# Altium schematic sheet mx8m_phy.SchDoc
size A2; SheetNumber: 8; SheetTotal: 15
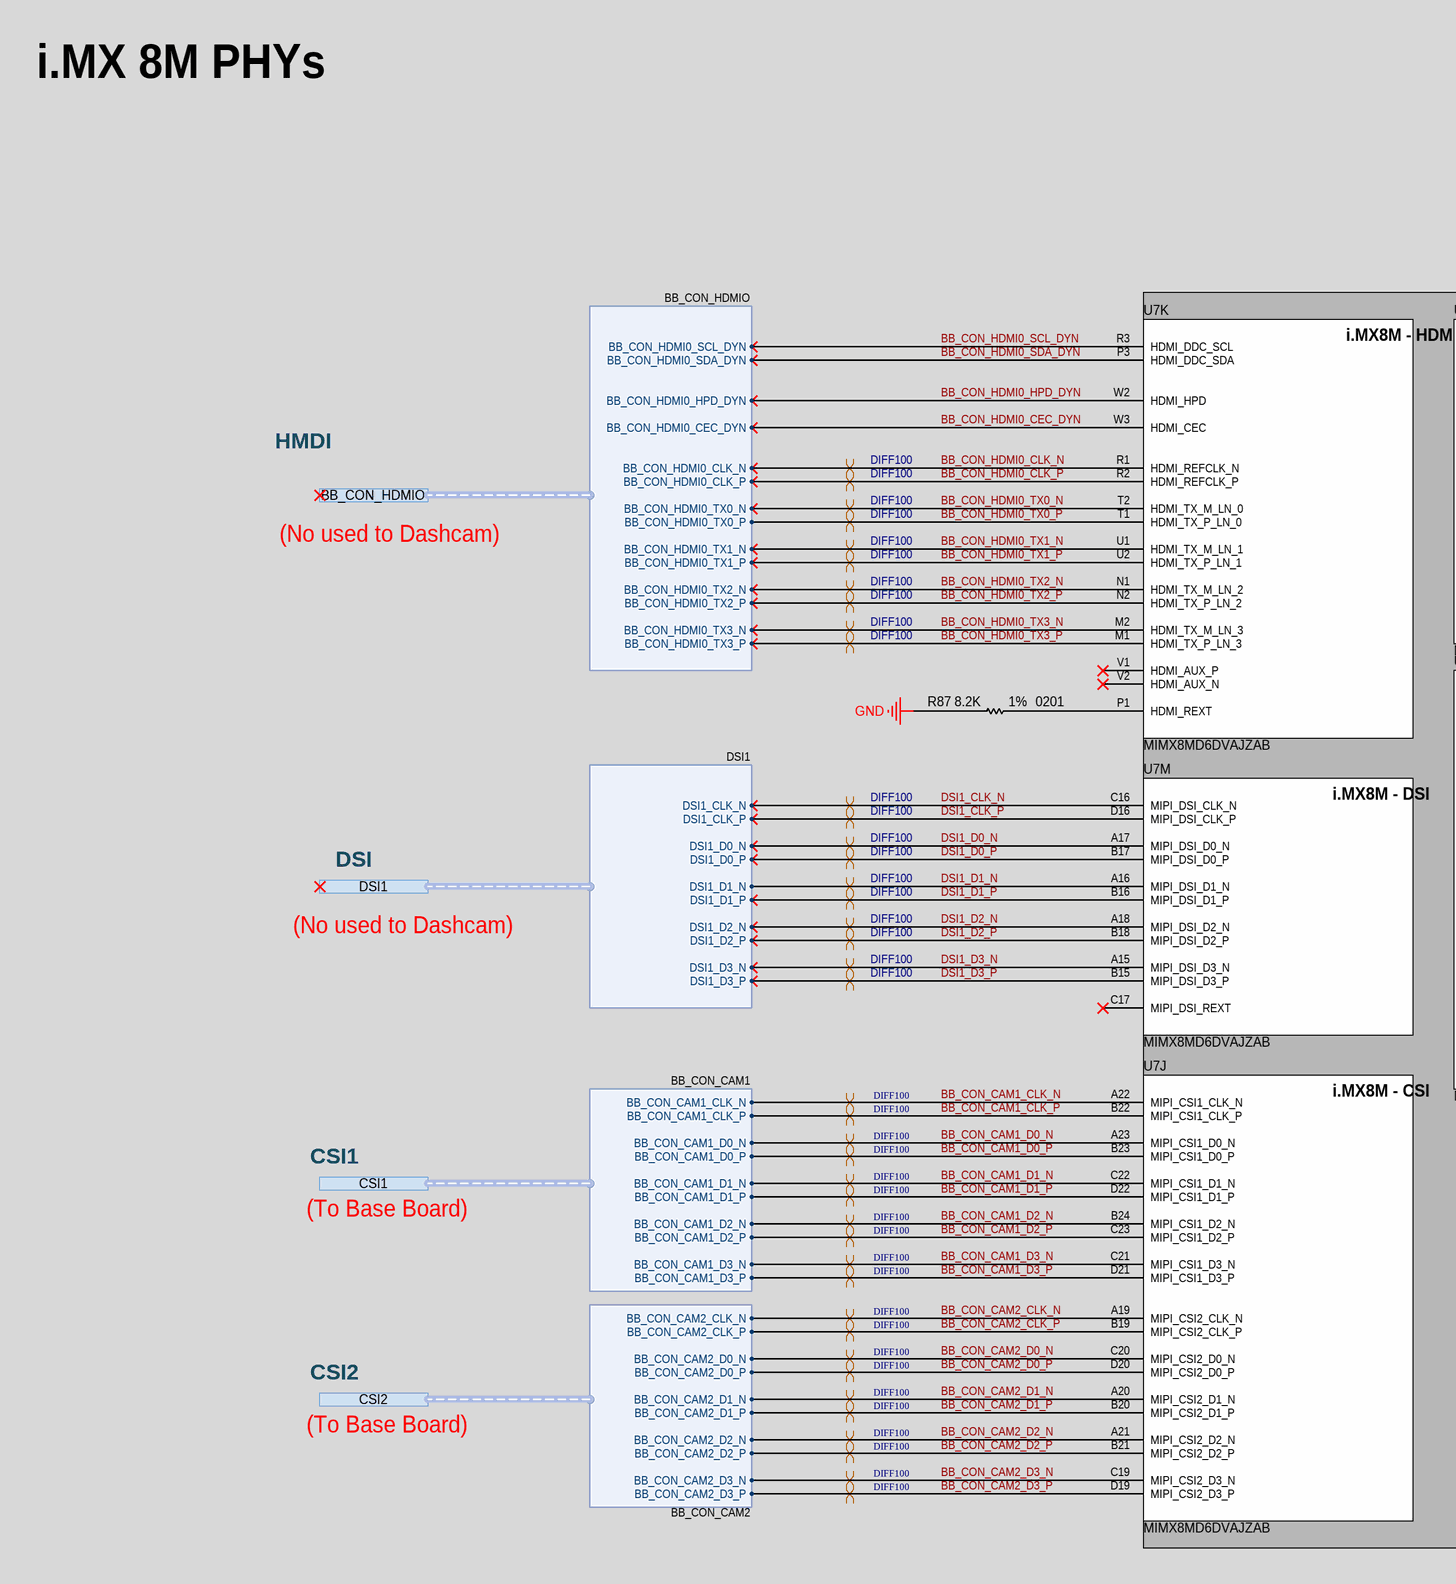
[diagram p0: mx8m_phy.SchDoc, left]
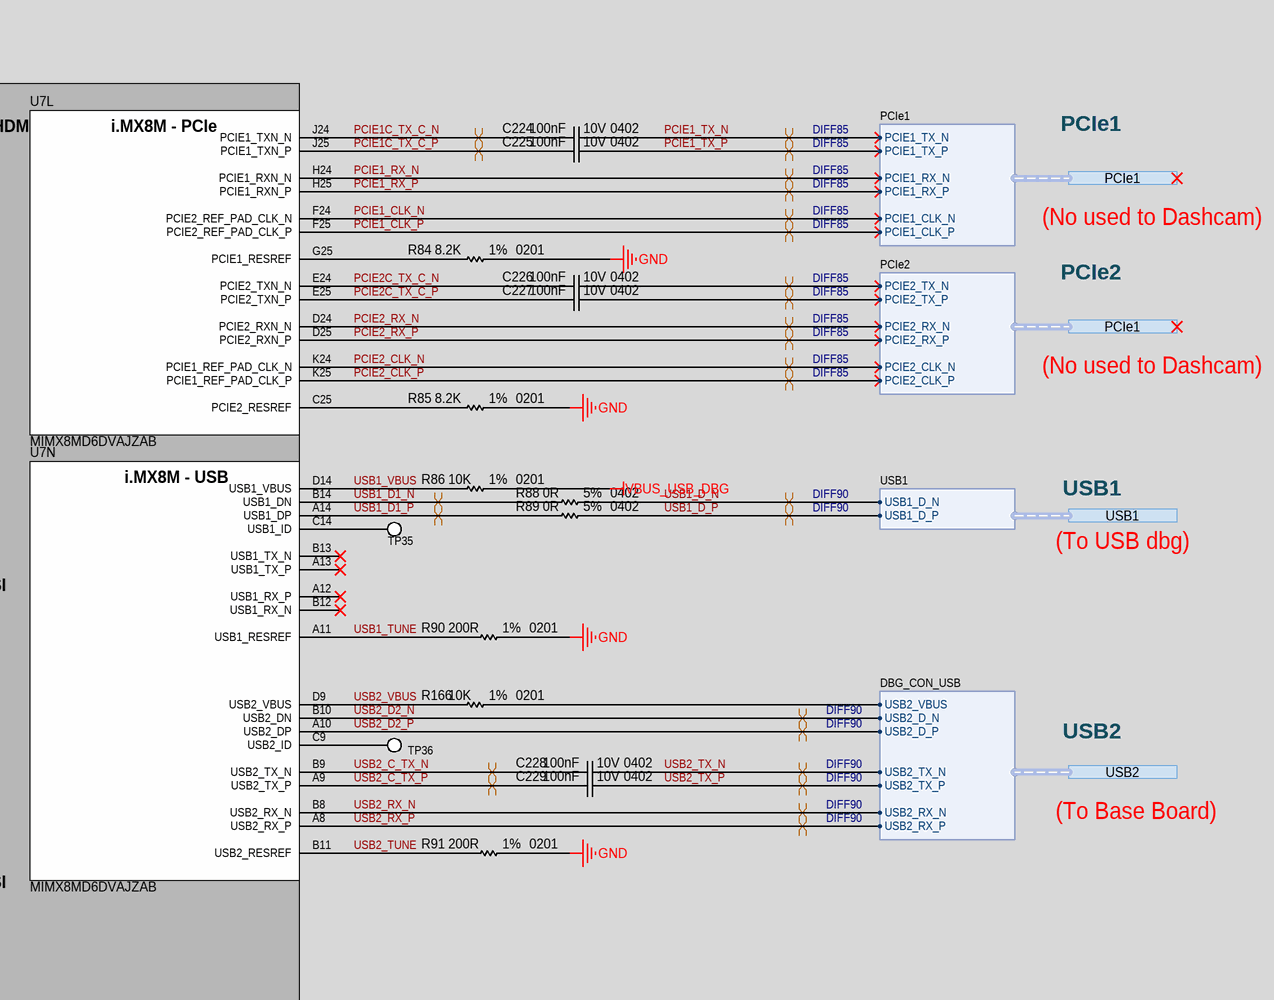
[diagram p1: mx8m_phy.SchDoc, right]

## Parts
C224  Case Code (Imperial): 0402  Voltage Rating (DC): 10V  Capacitance: 100nF  [CAP_0402_CAPC1005X05N]  (hidden comment: GRM155R61A104KA01D)
C225  Case Code (Imperial): 0402  Voltage Rating (DC): 10V  Capacitance: 100nF  [CAP_0402_CAPC1005X05N]  (hidden comment: GRM155R61A104KA01D)
C226  Case Code (Imperial): 0402  Voltage Rating (DC): 10V  Capacitance: 100nF  [CAP_0402_CAPC1005X05N]  (hidden comment: GRM155R61A104KA01D)
C227  Case Code (Imperial): 0402  Voltage Rating (DC): 10V  Capacitance: 100nF  [CAP_0402_CAPC1005X05N]  (hidden comment: GRM155R61A104KA01D)
C228  Case Code (Imperial): 0402  Voltage Rating (DC): 10V  Capacitance: 100nF  [CAP_0402_CAPC1005X05N]  (hidden comment: GRM155R61A104KA01D)
C229  Case Code (Imperial): 0402  Voltage Rating (DC): 10V  Capacitance: 100nF  [CAP_0402_CAPC1005X05N]  (hidden comment: GRM155R61A104KA01D)
R84  Tolerance: 1%  Resistance: 8.2K  Case/Package: 0201  [RES_0201_RESC0603X02N]  (hidden comment: RC0201FR-078K2L)
R85  Tolerance: 1%  Resistance: 8.2K  Case/Package: 0201  [RES_0201_RESC0603X02N]  (hidden comment: RC0201FR-078K2L)
R86  Tolerance: 1%  Resistance: 10K  Case Code (Imperial): 0201  [RES_0201_RESC0603X02N]  (hidden comment: RC0201FR-0710KL)
R87  Tolerance: 1%  Resistance: 8.2K  Case/Package: 0201  [RES_0201_RESC0603X02N]  (hidden comment: RC0201FR-078K2L)
R88  Case Code (Imperial): 0402  Tolerance: 5%  Resistance: 0R  [RES_0402_RESC1005X04N]  (hidden comment: ERJ-2GE0R00X)
R89  Case Code (Imperial): 0402  Tolerance: 5%  Resistance: 0R  [RES_0402_RESC1005X04N]  (hidden comment: ERJ-2GE0R00X)
R90  Tolerance: 1%  Resistance: 200R  Case/Package: 0201  [RES_0201_RESC0603X02N]  (hidden comment: RC0201FR-07200RL)
R91  Tolerance: 1%  Resistance: 200R  Case/Package: 0201  [RES_0201_RESC0603X02N]  (hidden comment: RC0201FR-07200RL)
R166  Tolerance: 1%  Resistance: 10K  Case Code (Imperial): 0201  [RES_0201_RESC0603X02N]  (hidden comment: RC0201FR-0710KL)
TP35  NO COMPONENT  [TP_PAD_1.6MM_SMD_ROUND]  (value not drawn)  (no BOM)
TP36  NO COMPONENT  [TP_PAD_1.6MM_SMD_ROUND]  (value not drawn)  (no BOM)
U7  MIMX8MD6DVAJZAB  [IC_MPU_BGA621C65P25X25_1700X1700X218]  (parts J,K,L,M,N of 14)

## Ports
BB_CON_HDMIO (harness BB_CON_HDMIO), CSI1 (harness BB_CON_CAM1), CSI2 (harness BB_CON_CAM2), DSI1 (harness DSI1), PCIe1 (harness PCIe1), PCIe1 (harness PCIe2), USB1 (harness USB1), USB2 (harness DBG_CON_USB)

## Harnesses
PCIe1: PCIE1_TX_N, PCIE1_TX_P, PCIE1_RX_N, PCIE1_RX_P, PCIE1_CLK_N, PCIE1_CLK_P
PCIe2: PCIE2_TX_N, PCIE2_TX_P, PCIE2_RX_N, PCIE2_RX_P, PCIE2_CLK_N, PCIE2_CLK_P
USB1: USB1_D_N, USB1_D_P
DBG_CON_USB: USB2_VBUS, USB2_D_N, USB2_D_P, USB2_TX_N, USB2_TX_P, USB2_RX_N, USB2_RX_P
BB_CON_HDMIO: BB_CON_HDMI0_SCL_DYN, BB_CON_HDMI0_SDA_DYN, BB_CON_HDMI0_HPD_DYN, BB_CON_HDMI0_CEC_DYN, BB_CON_HDMI0_CLK_N, BB_CON_HDMI0_CLK_P, BB_CON_HDMI0_TX0_N, BB_CON_HDMI0_TX0_P, BB_CON_HDMI0_TX1_N, BB_CON_HDMI0_TX1_P, BB_CON_HDMI0_TX2_N, BB_CON_HDMI0_TX2_P, BB_CON_HDMI0_TX3_N, BB_CON_HDMI0_TX3_P
DSI1: DSI1_CLK_N, DSI1_CLK_P, DSI1_D0_N, DSI1_D0_P, DSI1_D1_N, DSI1_D1_P, DSI1_D2_N, DSI1_D2_P, DSI1_D3_N, DSI1_D3_P
BB_CON_CAM1: BB_CON_CAM1_CLK_N, BB_CON_CAM1_CLK_P, BB_CON_CAM1_D0_N, BB_CON_CAM1_D0_P, BB_CON_CAM1_D1_N, BB_CON_CAM1_D1_P, BB_CON_CAM1_D2_N, BB_CON_CAM1_D2_P, BB_CON_CAM1_D3_N, BB_CON_CAM1_D3_P
BB_CON_CAM2: BB_CON_CAM2_CLK_N, BB_CON_CAM2_CLK_P, BB_CON_CAM2_D0_N, BB_CON_CAM2_D0_P, BB_CON_CAM2_D1_N, BB_CON_CAM2_D1_P, BB_CON_CAM2_D2_N, BB_CON_CAM2_D2_P, BB_CON_CAM2_D3_N, BB_CON_CAM2_D3_P

## Nets
GND: R84.2 R85.2 R87.1 R90.2 R91.2
VBUS_USB_DBG: R86.2
BB_CON_CAM1_CLK_N: U7.A22(MIPI_CSI1_CLK_N) ; port CSI1.BB_CON_CAM1_CLK_N
BB_CON_CAM1_CLK_P: U7.B22(MIPI_CSI1_CLK_P) ; port CSI1.BB_CON_CAM1_CLK_P
BB_CON_CAM1_D0_N: U7.A23(MIPI_CSI1_D0_N) ; port CSI1.BB_CON_CAM1_D0_N
BB_CON_CAM1_D0_P: U7.B23(MIPI_CSI1_D0_P) ; port CSI1.BB_CON_CAM1_D0_P
BB_CON_CAM1_D1_N: U7.C22(MIPI_CSI1_D1_N) ; port CSI1.BB_CON_CAM1_D1_N
BB_CON_CAM1_D1_P: U7.D22(MIPI_CSI1_D1_P) ; port CSI1.BB_CON_CAM1_D1_P
BB_CON_CAM1_D2_N: U7.B24(MIPI_CSI1_D2_N) ; port CSI1.BB_CON_CAM1_D2_N
BB_CON_CAM1_D2_P: U7.C23(MIPI_CSI1_D2_P) ; port CSI1.BB_CON_CAM1_D2_P
BB_CON_CAM1_D3_N: U7.C21(MIPI_CSI1_D3_N) ; port CSI1.BB_CON_CAM1_D3_N
BB_CON_CAM1_D3_P: U7.D21(MIPI_CSI1_D3_P) ; port CSI1.BB_CON_CAM1_D3_P
BB_CON_CAM2_CLK_N: U7.A19(MIPI_CSI2_CLK_N) ; port CSI2.BB_CON_CAM2_CLK_N
BB_CON_CAM2_CLK_P: U7.B19(MIPI_CSI2_CLK_P) ; port CSI2.BB_CON_CAM2_CLK_P
BB_CON_CAM2_D0_N: U7.C20(MIPI_CSI2_D0_N) ; port CSI2.BB_CON_CAM2_D0_N
BB_CON_CAM2_D0_P: U7.D20(MIPI_CSI2_D0_P) ; port CSI2.BB_CON_CAM2_D0_P
BB_CON_CAM2_D1_N: U7.A20(MIPI_CSI2_D1_N) ; port CSI2.BB_CON_CAM2_D1_N
BB_CON_CAM2_D1_P: U7.B20(MIPI_CSI2_D1_P) ; port CSI2.BB_CON_CAM2_D1_P
BB_CON_CAM2_D2_N: U7.A21(MIPI_CSI2_D2_N) ; port CSI2.BB_CON_CAM2_D2_N
BB_CON_CAM2_D2_P: U7.B21(MIPI_CSI2_D2_P) ; port CSI2.BB_CON_CAM2_D2_P
BB_CON_CAM2_D3_N: U7.C19(MIPI_CSI2_D3_N) ; port CSI2.BB_CON_CAM2_D3_N
BB_CON_CAM2_D3_P: U7.D19(MIPI_CSI2_D3_P) ; port CSI2.BB_CON_CAM2_D3_P
BB_CON_HDMI0_CEC_DYN: U7.W3(HDMI_CEC) ; port BB_CON_HDMIO.BB_CON_HDMI0_CEC_DYN
BB_CON_HDMI0_CLK_N: U7.R1(HDMI_REFCLK_N) ; port BB_CON_HDMIO.BB_CON_HDMI0_CLK_N
BB_CON_HDMI0_CLK_P: U7.R2(HDMI_REFCLK_P) ; port BB_CON_HDMIO.BB_CON_HDMI0_CLK_P
BB_CON_HDMI0_HPD_DYN: U7.W2(HDMI_HPD) ; port BB_CON_HDMIO.BB_CON_HDMI0_HPD_DYN
BB_CON_HDMI0_SCL_DYN: U7.R3(HDMI_DDC_SCL) ; port BB_CON_HDMIO.BB_CON_HDMI0_SCL_DYN
BB_CON_HDMI0_SDA_DYN: U7.P3(HDMI_DDC_SDA) ; port BB_CON_HDMIO.BB_CON_HDMI0_SDA_DYN
BB_CON_HDMI0_TX0_N: U7.T2(HDMI_TX_M_LN_0) ; port BB_CON_HDMIO.BB_CON_HDMI0_TX0_N
BB_CON_HDMI0_TX0_P: U7.T1(HDMI_TX_P_LN_0) ; port BB_CON_HDMIO.BB_CON_HDMI0_TX0_P
BB_CON_HDMI0_TX1_N: U7.U1(HDMI_TX_M_LN_1) ; port BB_CON_HDMIO.BB_CON_HDMI0_TX1_N
BB_CON_HDMI0_TX1_P: U7.U2(HDMI_TX_P_LN_1) ; port BB_CON_HDMIO.BB_CON_HDMI0_TX1_P
BB_CON_HDMI0_TX2_N: U7.N1(HDMI_TX_M_LN_2) ; port BB_CON_HDMIO.BB_CON_HDMI0_TX2_N
BB_CON_HDMI0_TX2_P: U7.N2(HDMI_TX_P_LN_2) ; port BB_CON_HDMIO.BB_CON_HDMI0_TX2_P
BB_CON_HDMI0_TX3_N: U7.M2(HDMI_TX_M_LN_3) ; port BB_CON_HDMIO.BB_CON_HDMI0_TX3_N
BB_CON_HDMI0_TX3_P: U7.M1(HDMI_TX_P_LN_3) ; port BB_CON_HDMIO.BB_CON_HDMI0_TX3_P
DSI1_CLK_N: U7.C16(MIPI_DSI_CLK_N) ; port DSI1.DSI1_CLK_N
DSI1_CLK_P: U7.D16(MIPI_DSI_CLK_P) ; port DSI1.DSI1_CLK_P
DSI1_D0_N: U7.A17(MIPI_DSI_D0_N) ; port DSI1.DSI1_D0_N
DSI1_D0_P: U7.B17(MIPI_DSI_D0_P) ; port DSI1.DSI1_D0_P
DSI1_D1_N: U7.A16(MIPI_DSI_D1_N) ; port DSI1.DSI1_D1_N
DSI1_D1_P: U7.B16(MIPI_DSI_D1_P) ; port DSI1.DSI1_D1_P
DSI1_D2_N: U7.A18(MIPI_DSI_D2_N) ; port DSI1.DSI1_D2_N
DSI1_D2_P: U7.B18(MIPI_DSI_D2_P) ; port DSI1.DSI1_D2_P
DSI1_D3_N: U7.A15(MIPI_DSI_D3_N) ; port DSI1.DSI1_D3_N
DSI1_D3_P: U7.B15(MIPI_DSI_D3_P) ; port DSI1.DSI1_D3_P
PCIE1_CLK_N: U7.F24(PCIE2_REF_PAD_CLK_N) ; port PCIe1.PCIE1_CLK_N
PCIE1_CLK_P: U7.F25(PCIE2_REF_PAD_CLK_P) ; port PCIe1.PCIE1_CLK_P
PCIE1_RX_N: U7.H24(PCIE1_RXN_N) ; port PCIe1.PCIE1_RX_N
PCIE1_RX_P: U7.H25(PCIE1_RXN_P) ; port PCIe1.PCIE1_RX_P
PCIE1_TX_N: C224.2 ; port PCIe1.PCIE1_TX_N
PCIE1_TX_P: C225.2 ; port PCIe1.PCIE1_TX_P
PCIE1C_TX_C_N: C224.1 U7.J24(PCIE1_TXN_N)
PCIE1C_TX_C_P: C225.1 U7.J25(PCIE1_TXN_P)
PCIE2_CLK_N: U7.K24(PCIE1_REF_PAD_CLK_N) ; port PCIe1.PCIE2_CLK_N
PCIE2_CLK_P: U7.K25(PCIE1_REF_PAD_CLK_P) ; port PCIe1.PCIE2_CLK_P
PCIE2_RX_N: U7.D24(PCIE2_RXN_N) ; port PCIe1.PCIE2_RX_N
PCIE2_RX_P: U7.D25(PCIE2_RXN_P) ; port PCIe1.PCIE2_RX_P
PCIE2C_TX_C_N: C226.1 U7.E24(PCIE2_TXN_N)
PCIE2C_TX_C_P: C227.1 U7.E25(PCIE2_TXN_P)
USB1_D1_N: R88.1 U7.B14(USB1_DN)
USB1_D1_P: R89.1 U7.A14(USB1_DP)
USB1_D_N: R88.2 ; port USB1.USB1_D_N
USB1_D_P: R89.2 ; port USB1.USB1_D_P
USB1_TUNE: R90.1 U7.A11(USB1_RESREF)
USB1_VBUS: R86.1 U7.D14(USB1_VBUS)
USB2_C_TX_N: C228.1 U7.B9(USB2_TX_N)
USB2_C_TX_P: C229.1 U7.A9(USB2_TX_P)
USB2_D2_N: U7.B10(USB2_DN) ; port USB2.USB2_D_N
USB2_D2_P: U7.A10(USB2_DP) ; port USB2.USB2_D_P
USB2_RX_N: U7.B8(USB2_RX_N) ; port USB2.USB2_RX_N
USB2_RX_P: U7.A8(USB2_RX_P) ; port USB2.USB2_RX_P
USB2_TUNE: R91.1 U7.B11(USB2_RESREF)
USB2_TX_N: C228.2 ; port USB2.USB2_TX_N
USB2_TX_P: C229.2 ; port USB2.USB2_TX_P
USB2_VBUS: R166.1 U7.D9(USB2_VBUS)
NetC226_2: C226.2 ; port PCIe1.PCIE2_TX_N
NetC227_2: C227.2 ; port PCIe1.PCIE2_TX_P
NetR84_1: R84.1 U7.G25(PCIE1_RESREF)
NetR85_1: R85.1 U7.C25(PCIE2_RESREF)
NetR87_2: R87.2 U7.P1(HDMI_REXT)
NetR166_2: R166.2 ; port USB2.USB2_VBUS
NetTP35_1: TP35.1 U7.C14(USB1_ID)
NetTP36_1: TP36.1 U7.C9(USB2_ID)

Not connected (* = marked no-connect by the designer): U7 A12(USB1_RX_P)* A13(USB1_TX_P)* B12(USB1_RX_N)* B13(USB1_TX_N)* C17(MIPI_DSI_REXT)* V1(HDMI_AUX_P)* V2(HDMI_AUX_N)*

## Layout directives
differential pair; differential pair class DIFF100: BB_CON_CAM1_CLK_N, BB_CON_CAM1_CLK_P, BB_CON_CAM1_D0_N, BB_CON_CAM1_D0_P, BB_CON_CAM1_D1_N, BB_CON_CAM1_D1_P, BB_CON_CAM1_D2_N, BB_CON_CAM1_D2_P, BB_CON_CAM1_D3_N, BB_CON_CAM1_D3_P, BB_CON_CAM2_CLK_N, BB_CON_CAM2_CLK_P, BB_CON_CAM2_D0_N, BB_CON_CAM2_D0_P, BB_CON_CAM2_D1_N, BB_CON_CAM2_D1_P, BB_CON_CAM2_D2_N, BB_CON_CAM2_D2_P, BB_CON_CAM2_D3_N, BB_CON_CAM2_D3_P, BB_CON_HDMI0_CLK_N, BB_CON_HDMI0_CLK_P, BB_CON_HDMI0_TX0_N, BB_CON_HDMI0_TX0_P, BB_CON_HDMI0_TX1_N, BB_CON_HDMI0_TX1_P, BB_CON_HDMI0_TX2_N, BB_CON_HDMI0_TX2_P, BB_CON_HDMI0_TX3_N, BB_CON_HDMI0_TX3_P, DSI1_CLK_N, DSI1_CLK_P, DSI1_D0_N, DSI1_D0_P, DSI1_D1_N, DSI1_D1_P, DSI1_D2_N, DSI1_D2_P, DSI1_D3_N, DSI1_D3_P
differential pair; differential pair class DIFF85: NetC226_2, NetC227_2, PCIE1_CLK_N, PCIE1_CLK_P, PCIE1_RX_N, PCIE1_RX_P, PCIE1_TX_N, PCIE1_TX_P, PCIE1C_TX_C_N, PCIE1C_TX_C_P, PCIE2_CLK_N, PCIE2_CLK_P, PCIE2_RX_N, PCIE2_RX_P
differential pair; differential pair class DIFF90: USB1_D1_N, USB1_D1_P, USB1_D_N, USB1_D_P, USB2_C_TX_N, USB2_C_TX_P, USB2_D2_N, USB2_D2_P, USB2_RX_N, USB2_RX_P, USB2_TX_N, USB2_TX_P

## Notes on the sheet
- i.MX 8M PHYs
- PCIe1
- HMDI
- (No used to Dashcam)
- PCIe2
- USB1
- (To USB dbg)
- DSI
- USB2
- (To Base Board)
- CSI1
- CSI2
- PCB Des :
- Approv By :
- Project Title :
- Sheet Title :
- Date :
- Page :
- PCB Version :
- PCB Revision :
- Size :
- A2
- (in symbol IC_MPU_ARM_1.5GHZ_MIMX8MD6DVAJZAB, part J) i.MX8M - CSI
- (in symbol IC_MPU_ARM_1.5GHZ_MIMX8MD6DVAJZAB, part K) i.MX8M - HDMI
- (in symbol IC_MPU_ARM_1.5GHZ_MIMX8MD6DVAJZAB, part L) i.MX8M - PCIe
- (in symbol IC_MPU_ARM_1.5GHZ_MIMX8MD6DVAJZAB, part M) i.MX8M - DSI
- (in symbol IC_MPU_ARM_1.5GHZ_MIMX8MD6DVAJZAB, part N) i.MX8M - USB

## Library data of the parts
C224-C229 = CAP_100nF_10V_X5R_0402: Multilayer Ceramic Capacitor, 0.1 uF, 10 V, ± 10%, X5R, 0402 [1005 Metric]; Manufacturer: Murata; Supplier 1: Digikey; Manufacturer Part Number: GRM155R61A104KA01D; RoHS: Yes; Category: Ceramic Capacitors; Stock 1: 2175825; Pricing 1: 1=0.1, 10=0.033, 50=0.0192, 100=0.0148, 500=0.01118, 1000=0.00878, 2500=0.00798, 5000=0.00734 (USD); Mount: Surface Mount; Case/Package: 0402; Number of Pins: 2; Case Code (Metric): 1005; Min Operating Temperature: -55°C; Max Operating Temperature: 85°C; Tolerance: 10%; Packaging: Tape and Reel; Voltage Rating: 10V; Package Quantity: 1; Dielectric: X5R; Termination: SMD/SMT; Voltage: 10V; Series: GRM; Length: 1mm; Width: 0.02inch; Height: 0.5mm; Thickness: 0.022inch; Depth: 0.5mm; Radiation Hardening: No; Reach SVHC Compliant: No; Lead Free: Lead Free; RoHS Compliant: Yes; ComponentLink1URL: https://datasheet.ciiva.com/162/product-162752.pdf?src-supplier=Digikey; ComponentLink1Description: https://datasheet.ciiva.com/162/product-162752.pdf?src-supplier=Digikey; ComponentLink2URL: https://datasheet.ciiva.com/18102/getdatasheetpartid-74533-18102605.pdf?src-supplier=Verical; ComponentLink2Description: https://datasheet.ciiva.com/18102/getdatasheetpartid-74533-18102605.pdf?src-supplier=Verical; ComponentLink3URL: https://datasheet.ciiva.com/162/partnumbering-e-01-162751.pdf?src-supplier=Digikey; ComponentLink3Description: https://datasheet.ciiva.com/162/partnumbering-e-01-162751.pdf?src-supplier=Digikey; ComponentLink4URL: https://datasheet.ciiva.com/162/partnumbering-e-01-162753.pdf?src-supplier=Digikey; ComponentLink4Description: https://datasheet.ciiva.com/162/partnumbering-e-01-162753.pdf?src-supplier=Digikey; ComponentLink5URL: https://datasheet.ciiva.com/22698/608985-22698411.pdf?src-supplier=Element14; ComponentLink5Description: https://datasheet.ciiva.com/22698/608985-22698411.pdf?src-supplier=Element14; ComponentLink6URL: https://datasheet.ciiva.com/28584/608985-28584203.pdf?src-supplier=Element14; ComponentLink6Description: https://datasheet.ciiva.com/28584/608985-28584203.pdf?src-supplier=Element14; ComponentLink7URL: https://datasheet.ciiva.com/28685/608985-28685384.pdf?src-supplier=Element14; ComponentLink7Description: https://datasheet.ciiva.com/28685/608985-28685384.pdf?src-supplier=Element14; ComponentLink8URL: https://datasheet.ciiva.com/16199/product-16199050.pdf?src-supplier=Future+Electronics; ComponentLink8Description: https://datasheet.ciiva.com/16199/product-16199050.pdf?src-supplier=Future+Electronics; ComponentLink9URL: https://datasheet.ciiva.com/7718/608985-7718999.pdf?src-supplier=Element14; ComponentLink9Description: https://datasheet.ciiva.com/7718/608985-7718999.pdf?src-supplier=Element14; Supplier Part Number 1: 490-1318-1-ND
R84 R85 R87 = RES_8.2K_1%_50mW_0201: Res Thick Film 0201 8.2K Ohm 1% 1/20W ±200ppm/°C Molded SMD Paper T/R; Manufacturer: Yageo; Power Rating: 50mW; Voltage Rating: 25V; Supplier 1: Digikey; Manufacturer Part Number: RC0201FR-078K2L; RoHS: Yes; Category: Chip SMD Resistors; Stock 1: 120132; Pricing 1: 1=0.1, 10=0.027, 50=0.0172, 100=0.0143, 500=0.00988, 1000=0.00854, 5000=0.00629 (USD); Case Code (Metric): 0603; Case Code (Imperial): 0201; Min Operating Temperature: -55°C; Max Operating Temperature: 125°C; Package Quantity: 10000; Packaging: Tape and Reel; Resistor Type: Thick Film; Number of Terminations: 2; Termination: SMD/SMT; Max Power Dissipation: 50mW; Temperature Coefficient: 200ppm/°C; Features: Moisture Resistant; Series: RC; Resistance Tolerance: 1%; Length: 0.024inch; Width: 0.3mm; Height: 0.01inch; Reach SVHC Compliant: No; Lead Free: Lead Free; RoHS Compliant: Yes; ComponentLink1URL: https://datasheet.ciiva.com/14985/pyu-r-int-thick-7-14985436.pdf?src-supplier=Digikey; ComponentLink1Description: https://datasheet.ciiva.com/14985/pyu-r-int-thick-7-14985436.pdf?src-supplier=Digikey; Supplier Part Number 1: YAG2353CT-ND
R86 R166 = RES_10K_1/12W_1%_0201: SMD Chip Resistor, 10 kOhm, ± 1%, 50 mW, 0201 [0603 Metric], Thick Film, General Purpose; Manufacturer: Yageo; Temperature Coefficient: 200ppm/°C; Power Rating: 50mW; Voltage Rating: 25V; Supplier 1: Digikey; Manufacturer Part Number: RC0201FR-0710KL; RoHS: Yes; Category: Chip SMD Resistors; Stock 1: 12030325; Pricing 1: 1=0.1, 10=0.027, 50=0.0172, 100=0.0143, 500=0.00988, 1000=0.00854, 5000=0.00629 (USD); Case/Package: 0201; Number of Pins: 2NUMBER; Contact Plating: Tin,Matte; Case Code (Metric): 0603; Weight: 6E-06oz; Min Operating Temperature: -55°C; Max Operating Temperature: 125°C; Packaging: Tape and Reel; Package Quantity: 10000; Termination: SMD/SMT; Resistor Type: Thick Film; Series: RC; Number of Terminations: 2; Max Power Dissipation: 50mW; Working Voltage: 25V; Features: Moisture Resistant; Technology: THICK FILM; Resistance Tolerance: 1%; Construction: Rectangular; Voltage Rating (DC): 25V; Length: 0.6mm; Width: 0.012inch; Height: 0.01inch; Depth: 0.3mm; RoHS Compliant: Yes; Reach SVHC Compliant: No; Military Standard: Not; Lead Free: 5697LeadFree; ComponentLink1URL: https://datasheet.ciiva.com/7660/1421516-7660807.pdf?src-supplier=Element14; ComponentLink1Description: https://datasheet.ciiva.com/7660/1421516-7660807.pdf?src-supplier=Element14; ComponentLink2URL: https://datasheet.ciiva.com/46391/1421516-46391339.pdf?src-supplier=Element14; ComponentLink2Description: https://datasheet.ciiva.com/46391/1421516-46391339.pdf?src-supplier=Element14; ComponentLink3URL: https://datasheet.ciiva.com/2467/pyu-r-int-thick-7-2467110.pdf?src-supplier=Digikey; ComponentLink3Description: https://datasheet.ciiva.com/2467/pyu-r-int-thick-7-2467110.pdf?src-supplier=Digikey; ComponentLink4URL: https://datasheet.ciiva.com/2467/pyu-r-int-thick-7-2467111.pdf?src-supplier=Digikey; ComponentLink4Description: https://datasheet.ciiva.com/2467/pyu-r-int-thick-7-2467111.pdf?src-supplier=Digikey; ComponentLink5URL: https://datasheet.ciiva.com/2467/pyu-r-int-thick-7-2467109.pdf?src-supplier=Digikey; ComponentLink5Description: https://datasheet.ciiva.com/2467/pyu-r-int-thick-7-2467109.pdf?src-supplier=Digikey; ComponentLink6URL: https://datasheet.ciiva.com/26829/getdatasheetpartid-421074-26829851.pdf?src-supplier=Verical; ComponentLink6Description: https://datasheet.ciiva.com/26829/getdatasheetpartid-421074-26829851.pdf?src-supplier=Verical; ComponentLink7URL: https://datasheet.ciiva.com/8891/pyu-rc0201-51-rohs-l-8-8891384.pdf?src-supplier=Avnet; ComponentLink7Description: https://datasheet.ciiva.com/8891/pyu-rc0201-51-rohs-l-8-8891384.pdf?src-supplier=Avnet; Supplier Part Number 1: 311-10.0KMCT-ND
R88 R89 = RES_0R_5%_100mW_0402: SMD Chip Resistor, Jumper, 0 ohm, 100 mW, 0402 [1005 Metric], Thick Film, General Purpose; Manufacturer: Panasonic; Power Rating: 100mW; Voltage Rating: 50V; Temperature Coefficient: 600ppm/°C; Supplier 1: Mouser; Manufacturer Part Number: ERJ-2GE0R00X; RoHS: Yes; Category: Chip SMD Resistors; Stock 1: 10989354; Pricing 1: 1=0.1, 10=0.013, 50=0.013, 100=0.006, 1000=0.004, 2500=0.003, 10000=0.003 (USD); Mount: Surface Mount; Case/Package: 0402; Contact Plating: Tin; Case Code (Metric): 1005; Size Code: 0402; Min Operating Temperature: -55°C; Max Operating Temperature: 155°C; Resistor Type: Thick Film; Packaging: Cut Tape; Package Quantity: 10000; Number of Terminations: 2; Termination: SMD/SMT; Max Power Dissipation: 100mW; Voltage Rating (DC): 50V; Features: Automotive AEC-Q200; Series: ERJ; Construction: Rectangular; Technology: THICK FILM; Length: 1mm; Width: 0.5mm; Height: 0.35mm; Depth: 0.5mm; Ratings: AEC-Q200; Radiation Hardening: No; Reach SVHC Compliant: No; Military Standard: Not; Lead Free: Lead Free; RoHS Compliant: Yes; ComponentLink1URL: https://datasheet.ciiva.com/11821/0900766b80f806dd-11821176.pdf?src-supplier=Rs; ComponentLink1Description: https://datasheet.ciiva.com/11821/0900766b80f806dd-11821176.pdf?src-supplier=Rs; ComponentLink2URL: https://datasheet.ciiva.com/43460/1678796-43460347.pdf?src-supplier=Farnell; ComponentLink2Description: https://datasheet.ciiva.com/43460/1678796-43460347.pdf?src-supplier=Farnell; ComponentLink3URL: https://datasheet.ciiva.com/46389/1678796-46389518.pdf?src-supplier=Element14; ComponentLink3Description: https://datasheet.ciiva.com/46389/1678796-46389518.pdf?src-supplier=Element14; ComponentLink4URL: https://datasheet.ciiva.com/5959/1678796-5959692.pdf?src-supplier=Farnell; ComponentLink4Description: https://datasheet.ciiva.com/5959/1678796-5959692.pdf?src-supplier=Farnell; ComponentLink5URL: https://datasheet.ciiva.com/28695/1678796-28695758.pdf?src-supplier=Element14; ComponentLink5Description: https://datasheet.ciiva.com/28695/1678796-28695758.pdf?src-supplier=Element14; ComponentLink6URL: https://datasheet.ciiva.com/16783/70260739-16783734.pdf?src-supplier=Allied+Electronics; ComponentLink6Description: https://datasheet.ciiva.com/16783/70260739-16783734.pdf?src-supplier=Allied+Electronics; ComponentLink7URL: https://datasheet.ciiva.com/16778/70260739-16778335.pdf?src-supplier=Allied+Electronics; ComponentLink7Description: https://datasheet.ciiva.com/16778/70260739-16778335.pdf?src-supplier=Allied+Electronics; ComponentLink8URL: https://datasheet.ciiva.com/48531/aoa0000ce1-48531077.pdf?src-supplier=Avnet; ComponentLink8Description: https://datasheet.ciiva.com/48531/aoa0000ce1-48531077.pdf?src-supplier=Avnet; ComponentLink9URL: https://datasheet.ciiva.com/30097/4aoa0000ce1-30097116.pdf?src-supplier=Onlinecomponents.com; ComponentLink9Description: https://datasheet.ciiva.com/30097/4aoa0000ce1-30097116.pdf?src-supplier=Onlinecomponents.com; Supplier Part Number 1: 667-ERJ-2GE0R00X
R90 R91 = RES_200R_1%_50mW_0201: SMD Chip Resistor, 200 Ohm, ± 1%, 50 mW, 0201 [0603 Metric], Thick Film, General Purpose; Manufacturer: Yageo; Voltage Rating: 25V; Power Rating: 50mW; Temperature Coefficient: 200ppm/°C; Supplier 1: Mouser; Manufacturer Part Number: RC0201FR-07200RL; RoHS: Yes; Category: Chip SMD Resistors; Stock 1: 289096; Pricing 1: 1=0.1, 10=0.015, 50=0.015, 100=0.008, 1000=0.006, 10000=0.006 (USD); Case Code (Imperial): 0201; Case Code (Metric): 0603; Size Code: 0201; Min Operating Temperature: -55°C; Max Operating Temperature: 125°C; Package Quantity: 10000; Packaging: Tape and Reel; Termination: SMD/SMT; Number of Terminations: 2; Max Power Dissipation: 50mW; Features: Moisture Resistant; Series: RC; Length: 0.6mm; Width: 0.3mm; Height: 0.23mm; Lead Free: Lead Free; RoHS Compliant: Yes; ComponentLink1URL: http://www.mouser.com/ds/2/447/RC0201-559633.pdf?src-supplier=Mouser; ComponentLink1Description: http://www.mouser.com/ds/2/447/RC0201-559633.pdf?src-supplier=Mouser; ComponentLink2URL: https://datasheet.octopart.com/RC0201FR-07200RL-Yageo-datasheet-164759695.pdf?src-supplier=Future+Electronics; ComponentLink2Description: https://datasheet.octopart.com/RC0201FR-07200RL-Yageo-datasheet-164759695.pdf?src-supplier=Future+Electronics; ComponentLink3URL: http://www.yageo.com/documents/recent/PYu-RC0201_51_RoHS_L_(8).pdf?src-supplier=Future+Electronics; ComponentLink3Description: http://www.yageo.com/documents/recent/PYu-RC0201_51_RoHS_L_(8).pdf?src-supplier=Future+Electronics; ComponentLink4URL: http://www.yageo.com/documents/recent/PYu-RC_Group_51_RoHS_L_10.pdf?src-supplier=Digikey; ComponentLink4Description: http://www.yageo.com/documents/recent/PYu-RC_Group_51_RoHS_L_10.pdf?src-supplier=Digikey; ComponentLink5URL: http://www.yageo.com/documents/recent/PYu-RC_Group_51_RoHS_L_9.pdf?src-supplier=Digikey; ComponentLink5Description: http://www.yageo.com/documents/recent/PYu-RC_Group_51_RoHS_L_9.pdf?src-supplier=Digikey; Supplier Part Number 1: 603-RC0201FR-07200RL
TP35 TP36 = TP_PAD_SMD_Round: Test Point, SMD pad, round, 1.5mm, 1.6mm, 3mm diameter
U7 = IC_MPU_ARM_1.5GHZ_MIMX8MD6DVAJZAB: i.MX 8M: Cortex-A53 up to 1.5GHz and Cortex-M4 / TRAY TRAY MULTIPLE DP BAKEABLE RoHS Compliant: Yes; Manufacturer: NXP Semiconductors; Supplier 1: Digikey; Manufacturer Part Number: MIMX8MD6DVAJZAB; RoHS: Yes; Category: Microprocessors; Stock 1: 162; Pricing 1: 1=56.07, 10=46.184, 25=43.716, 90=41.175 (USD); RoHS Compliant: Yes; Supplier Part Number 1: 568-14717-ND